# EAGLE schematic connector_schematic (1) (EAGLE 9.3.2)
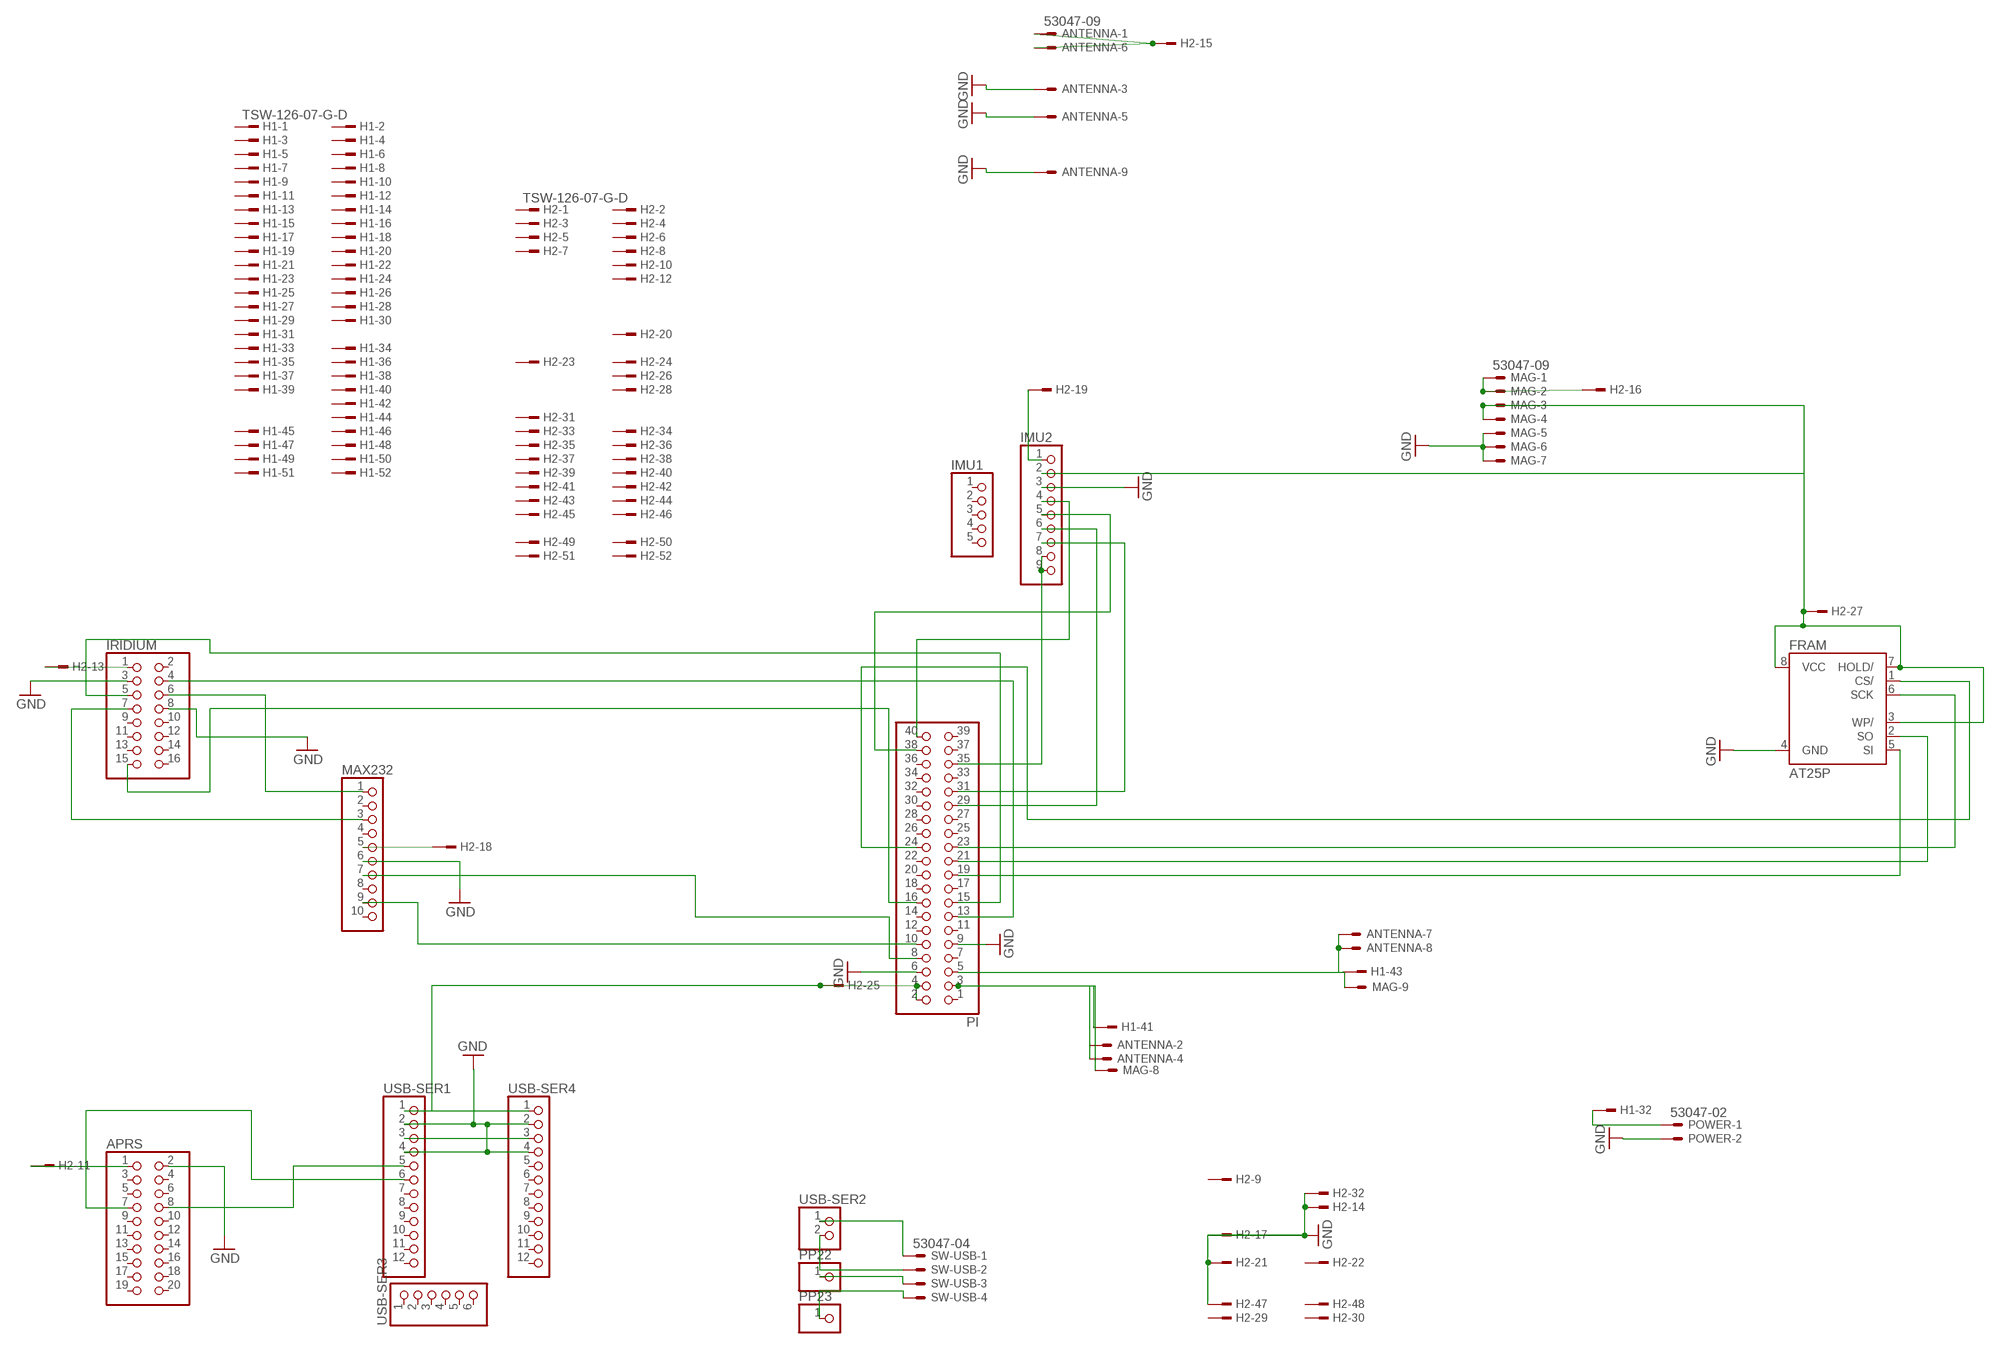
[diagram p0: schematic, sheet 1]

## Parts
ANTENNA  53047-09  [53047-09]
APRS  PINHD-2X10  [2X10]
FRAM  AT25P  [DIL08]
H1  TSW-126-07-G-D  [TSW-126-XX-G-D]
H2  TSW-126-07-G-D  [TSW-126-XX-G-D]
IMU1  PINHD-1X5  [1X05]
IMU2  PINHD-1X9  [1X09]
IRIDIUM  PINHD-2X8  [2X08]
MAG  53047-09  [53047-09]
MAX232  PINHD-1X10  [1X10]
PI  PINHD-2X20  [2X20]
POWER  53047-02  [53047-02]
PP22  PINHD-1X1  [1X01]
PP23  PINHD-1X1  [1X01]
SW-USB  53047-04  [53047-04]
USB-SER1  PINHD-1X12  [1X12]
USB-SER2  PINHD-1X2  [1X02]
USB-SER3  PINHD-1X6  [1X06]
USB-SER4  PINHD-1X12  [1X12]

## Nets
GND: ANTENNA.3 ANTENNA.5 ANTENNA.9 APRS.2 FRAM.4(GND) H2.14 H2.17 H2.21 H2.32 H2.47 IMU2.3 IRIDIUM.3 IRIDIUM.8 MAG.5 MAG.6 MAG.7 MAX232.6 PI.6 PI.9 POWER.2 USB-SER1.2 USB-SER1.4 USB-SER4.2 USB-SER4.4
N$1: H2.25 PI.2 PI.4 USB-SER1.1 USB-SER4.1
N$2: ANTENNA.2 ANTENNA.4 H1.41 MAG.8 PI.3
N$3: IMU2.5 PI.38
N$4: APRS.1 H2.11
N$5: H2.19 IMU2.1
N$6: ANTENNA.1 ANTENNA.6 H2.15
N$7: H2.13 IRIDIUM.1
N$8: IRIDIUM.4 PI.13
N$9: IRIDIUM.5 PI.15
N$10: IRIDIUM.15 PI.16
N$11: H2.16 MAG.1 MAG.2
N$12: MAX232.7 PI.8
N$13: H1.32 POWER.1
N$14: APRS.8 USB-SER1.5
N$15: APRS.7 USB-SER1.6
N$16: ANTENNA.7 ANTENNA.8 H1.43 MAG.9 PI.5
N$17: FRAM.5(SI) PI.19
N$18: FRAM.6(SCK) PI.23
N$19: FRAM.1(CS/) PI.24
N$20: FRAM.2(SO) PI.21
N$21: MAX232.9 PI.10
N$22: PP22.1 SW-USB.3
N$23: H2.18 MAX232.5
N$24: IRIDIUM.6 MAX232.1
N$25: IRIDIUM.7 MAX232.3
N$26: PP23.1 SW-USB.4
N$27: USB-SER2.1
N$28: SW-USB.2 USB-SER2.2
N$29: SW-USB.1
N$30: FRAM.3(WP/) FRAM.7(HOLD/) FRAM.8(VCC) H2.27 IMU2.2 MAG.3 MAG.4
N$31: USB-SER1.3 USB-SER4.3
N$32: IMU2.4 PI.40
N$33: IMU2.6 PI.29
N$34: IMU2.7 PI.31
N$35: IMU2.8 IMU2.9 PI.35
Unconnected: APRS.3 APRS.4 APRS.5 APRS.6 APRS.9 APRS.10 APRS.11 APRS.12 APRS.13 APRS.14 APRS.15 APRS.16 APRS.17 APRS.18 APRS.19 APRS.20 H1.1 H1.2 H1.3 H1.4 H1.5 H1.6 H1.7 H1.8 H1.9 H1.10 H1.11 H1.12 H1.13 H1.14 H1.15 H1.16 H1.17 H1.18 H1.19 H1.20 H1.21 H1.22 H1.23 H1.24 H1.25 H1.26 H1.27 H1.28 H1.29 H1.30 H1.31 H1.33 H1.34 H1.35 H1.36 H1.37 H1.38 H1.39 H1.40 H1.42 H1.44 H1.45 H1.46 H1.47 H1.48 H1.49 H1.50 H1.51 H1.52 H2.1 H2.2 H2.3 H2.4 H2.5 H2.6 H2.7 H2.8 H2.9 H2.10 H2.12 H2.20 H2.22 H2.23 H2.24 H2.26 H2.28 H2.29 H2.30 H2.31 H2.33 H2.34 H2.35 H2.36 H2.37 H2.38 H2.39 H2.40 H2.41 H2.42 H2.43 H2.44 H2.45 H2.46 H2.48 H2.49 H2.50 H2.51 H2.52 IMU1.1 IMU1.2 IMU1.3 IMU1.4 IMU1.5 IRIDIUM.2 IRIDIUM.9 IRIDIUM.10 IRIDIUM.11 IRIDIUM.12 IRIDIUM.13 IRIDIUM.14 IRIDIUM.16 MAX232.2 MAX232.4 MAX232.8 MAX232.10 PI.1 PI.7 PI.11 PI.12 PI.14 PI.17 PI.18 PI.20 PI.22 PI.25 PI.26 PI.27 PI.28 PI.30 PI.32 PI.33 PI.34 PI.36 PI.37 PI.39 USB-SER1.7 USB-SER1.8 USB-SER1.9 USB-SER1.10 USB-SER1.11 USB-SER1.12 USB-SER3.1 USB-SER3.2 USB-SER3.3 USB-SER3.4 USB-SER3.5 USB-SER3.6 USB-SER4.5 USB-SER4.6 USB-SER4.7 USB-SER4.8 USB-SER4.9 USB-SER4.10 USB-SER4.11 USB-SER4.12

## Library data of the parts
ANTENNA MAG = con-molex:53?-09: CONNECTOR wire to board 1.25 mm (.049 inch) pitch header; MF: MOLEX; MPN: 53047-0910; OC_FARNELL: 9732888; OC_NEWARK: 98K9827
APRS = pinhead:PINHD-2X10: PIN HEADER
FRAM = atmel:AT25*: SPI bus serial EEPROM; MPN: CAT25040LI-G; OC_FARNELL: 1718045; OC_NEWARK: 06R0588
H1 H2 = con-samtec:TSW-126-*-G: THROUGH-HOLE .025" SQ POST HEADER Source: Samtec TSW.pdf; MF: Samtec Inc.; MPN: TSW-126-07-G-D
IMU1 = pinhead:PINHD-1X5: PIN HEADER
IMU2 = pinhead:PINHD-1X9: PIN HEADER
IRIDIUM = pinhead:PINHD-2X8: PIN HEADER
MAX232 = pinhead:PINHD-1X10: PIN HEADER
PI = pinhead:PINHD-2X20: PIN HEADER
POWER = con-molex:53?-02: CONNECTOR wire to board 1.25 mm (.049 inch) pitch header; MF: MOLEX; MPN: 53047-0210; OC_FARNELL: 9733051; OC_NEWARK: 57H4701
PP22 PP23 = pinhead:PINHD-1X1: PIN HEADER
SW-USB = con-molex:53?-04: CONNECTOR wire to board 1.25 mm (.049 inch) pitch header; MF: WALDOM/MOLEX; MPN: 53047-0410; OC_FARNELL: 9733060; OC_NEWARK: 38C9900
USB-SER1 USB-SER4 = pinhead:PINHD-1X12: PIN HEADER
USB-SER2 = pinhead:PINHD-1X2: PIN HEADER
USB-SER3 = pinhead:PINHD-1X6: PIN HEADER